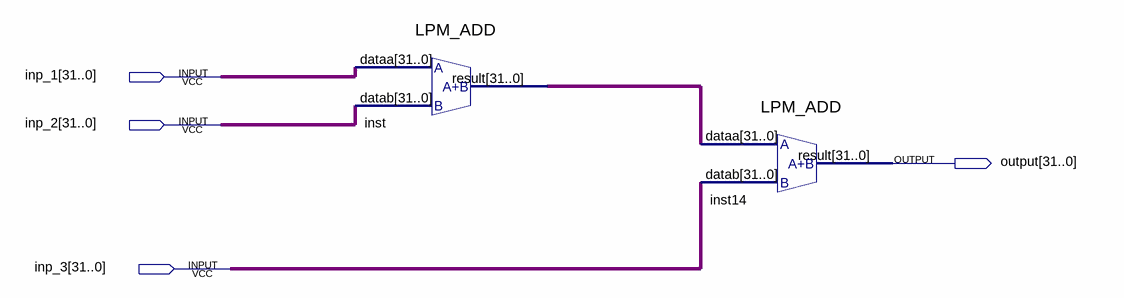
[diagram p0: schematic sheet]
// Quartus schematic adder_3_3.bdf as structural Verilog: 2 symbols, 4 pins
module adder_3_3 (
  input  [31:0] inp_1,
  input  [31:0] inp_2,
  input  [31:0] inp_3,
  output [31:0] \output 
);

  wire [31:0] inst_result;

  LPM_ADD inst (.dataa(inp_1), .datab(inp_2), .result(inst_result));
  LPM_ADD inst14 (.dataa(inst_result), .datab(inp_3), .result(\output ));
endmodule
